# Altium schematic sheet controller_peripherals.SchDoc
size A
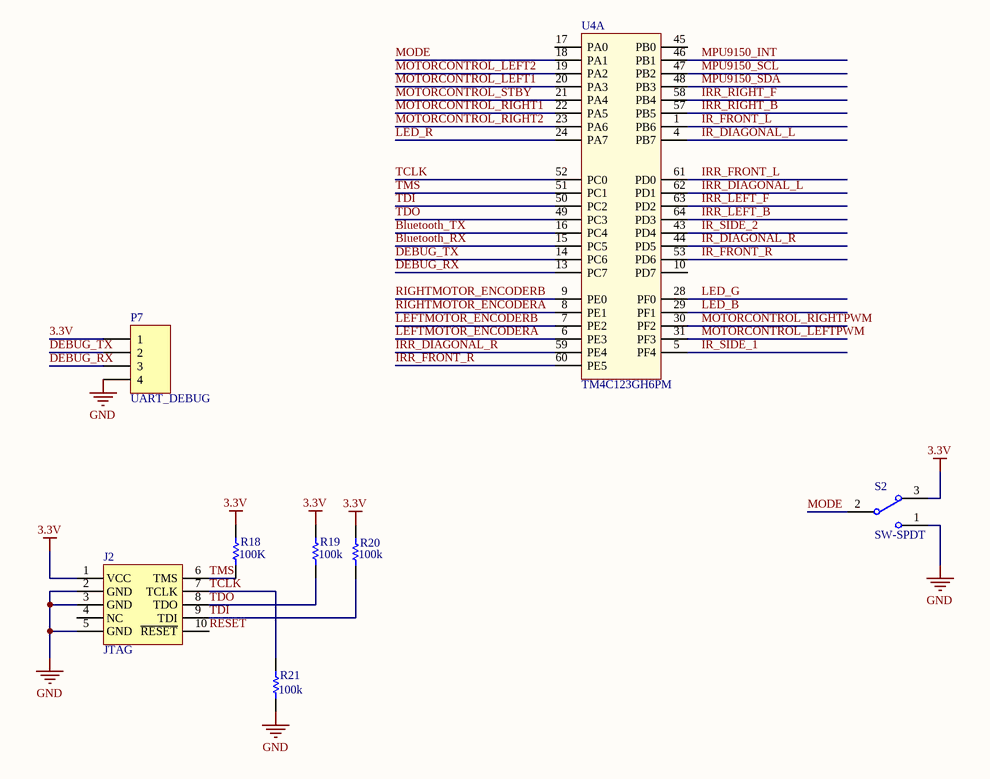
[diagram p0: controller_peripherals.SchDoc]

## Parts
J2  JTAG  [HDR2X5]
P7  UART_DEBUG  [HDR1X4]
R18  value 100K  [0603]  (hidden comment: Resistor)
R19  value 100k  [0603]  (hidden comment: Resistor)
R20  value 100k  [0603]  (hidden comment: Resistor)
R21  value 100k  [0603]  (hidden comment: Resistor)
S2  SW-SPDT  [SPDT Switch]
U4  TM4C123GH6PM  [TSQFP50P1200X1200X145-64N]  (part A of 2)

## Nets
3.3V: J2.1(VCC) P7.1 R18.2 R19.2 R20.2 S2.3
GND: J2.2(GND) J2.3(GND) J2.5(GND) P7.4 R21.1 S2.1
Bluetooth_RX: U4.15(PC5)
Bluetooth_TX: U4.16(PC4)
DEBUG_RX: P7.3 U4.13(PC7)
DEBUG_TX: P7.2 U4.14(PC6)
IR_DIAGONAL_L: U4.4(PB7)
IR_DIAGONAL_R: U4.44(PD5)
IR_FRONT_L: U4.1(PB6)
IR_FRONT_R: U4.53(PD6)
IR_SIDE_1: U4.5(PF4)
IR_SIDE_2: U4.43(PD4)
IRR_DIAGONAL_L: U4.62(PD1)
IRR_DIAGONAL_R: U4.59(PE4)
IRR_FRONT_L: U4.61(PD0)
IRR_FRONT_R: U4.60(PE5)
IRR_LEFT_B: U4.64(PD3)
IRR_LEFT_F: U4.63(PD2)
IRR_RIGHT_B: U4.57(PB5)
IRR_RIGHT_F: U4.58(PB4)
LED_B: U4.29(PF1)
LED_G: U4.28(PF0)
LED_R: U4.24(PA7)
LEFTMOTOR_ENCODERA: U4.6(PE3)
LEFTMOTOR_ENCODERB: U4.7(PE2)
MODE: S2.2 U4.18(PA1)
MOTORCONTROL_LEFT1: U4.20(PA3)
MOTORCONTROL_LEFT2: U4.19(PA2)
MOTORCONTROL_LEFTPWM: U4.31(PF3)
MOTORCONTROL_RIGHT1: U4.22(PA5)
MOTORCONTROL_RIGHT2: U4.23(PA6)
MOTORCONTROL_RIGHTPWM: U4.30(PF2)
MOTORCONTROL_STBY: U4.21(PA4)
MPU9150_INT: U4.46(PB1)
MPU9150_SCL: U4.47(PB2)
MPU9150_SDA: U4.48(PB3)
RESET: J2.10(~{RESET})
RIGHTMOTOR_ENCODERA: U4.8(PE1)
RIGHTMOTOR_ENCODERB: U4.9(PE0)
TCLK: J2.7(TCLK) R21.2 U4.52(PC0)
TDI: J2.9(TDI) R20.1 U4.50(PC2)
TDO: J2.8(TDO) R19.1 U4.49(PC3)
TMS: J2.6(TMS) R18.1 U4.51(PC1)

Not connected (* = marked no-connect by the designer): J2 4(NC); U4 10(PD7) 17(PA0) 45(PB0)

## Library data of the parts
J2 = 10-Pin JTAG ARM: 10-Pin JTAG Connector for Cortex M4 etc.
P7 = Header 4: Header, 4-Pin; LatestRevisionDate: 17-Jul-2002; LatestRevisionNote: Re-released for DXP Platform.; Publisher: Altium Limited
S2 = SW-SPDT: SPDT Subminiature Toggle Switch, Right Angle Mounting, Vertical Actuation; Published: 24-Mar-1999; LatestRevisionDate: 17-Dec-2003; LatestRevisionNote: Schematic revised, PCB Footprint replaced.; DatasheetVersion: 05-Dec-2000; PackageReference: TL36WW15050; Publisher: Altium Limited; PackageDescription: Switch; 4 Leads; ComponentLink1Description: Manufacturer Link; ComponentLink1URL: http://www.apem.com
U4 = TM4C123GH6PM: Tiva C TM4C123GH6PM
R18-R21 = Resistor: Published: 8-Jun-2000; LatestRevisionDate: 17-Jul-2002; LatestRevisionNote: Re-released for DXP Platform.; PackageReference: AXIAL-0.3; Publisher: Altium Limited